# Altium schematic sheet BSR033A_Hardware.SchDoc: LM5180EVM-S03 Buck Converter Hardware
size 431 x 279 mm; Date: Not shown in title block; ApprovedBy: Not shown in title block; CheckedBy: Not shown in title block; Author: Not shown in title block; CompanyName: Not shown in title block; DrawnBy: K. Nielson; Engineer: Not shown in title block; Organization: Not shown in title block; Address1: Not shown in title block; Address2: Not shown in title block; Address3: Not shown in title block; Address4: Not shown in title block; DocumentNumber: 2; Revision: Use project parameter SCH_Rev; SheetNumber: 2; SheetTotal: 2; PageSetup: Record=PageOptions|CenterHorizontal=True|CenterVertical=True|PrintScale=1.00|XCorrection=1.00|YCorrection=1.00|PrintKind=0|BorderSize=5000000|LeftOffset=0|BottomOffset=0|Orientation=2|PaperLength=1000|PaperWidth=1000|Scale=100|PaperSource=15|PrintQuality=600|MediaType=1|DitherType=10|PaperKind=Letter|PrintScaleMode=1; CurrentTime: Not shown in title block; CurrentDate: Not shown in title block; Time: Not shown in title block; DocumentFullPathAndName: Not shown in title block; DocumentName: Not shown in title block; ModifiedDate: Not shown in title block; ImagePath: Not shown in title block
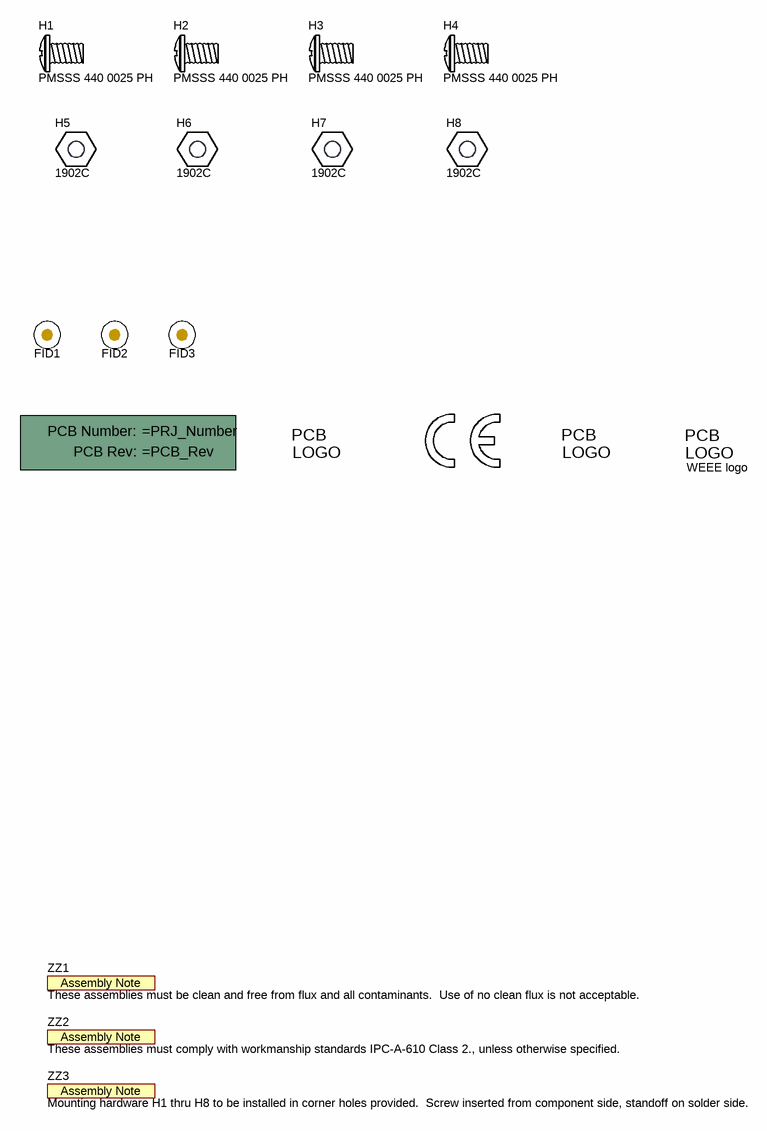
[diagram p0: BSR033A_Hardware.SchDoc]

## Parts
!PCB  Printed Circuit Board  (value not drawn)  (mechanical)
FID1  Fiducial  [Fiducial10-20]  (value not drawn)
FID2  Fiducial  [Fiducial10-20]  (value not drawn)
FID3  Fiducial  [Fiducial10-20]  (value not drawn)
H1  PMSSS 440 0025 PH  [B_F_PMSSS4400025PH]
H2  PMSSS 440 0025 PH  [B_F_PMSSS4400025PH]
H3  PMSSS 440 0025 PH  [B_F_PMSSS4400025PH]
H4  PMSSS 440 0025 PH  [B_F_PMSSS4400025PH]
H5  1902C  [Keystone_1902C]
H6  1902C  [Keystone_1902C]
H7  1902C  [Keystone_1902C]
H8  1902C  [Keystone_1902C]
Logo1  Texas Instruments  [TI_Stacked_Overlay_Small]  (value not drawn)  (no BOM)
Logo2  WEEE logo  [WEEE_Minimum]  (no BOM)
Logo3  FCC disclaimer  [FCC_disclaimer_stacked]  (value not drawn)  (no BOM)
LOGO4  CE Mark  [CE_Mark_5mm]  (value not drawn)  (no BOM)
ZZ1  These assemblies must be clean and free from flux and all contaminants.  Use of no clean flux is not acceptable.  [AssemblyNote]  (no BOM)
ZZ2  These assemblies must comply with workmanship standards IPC-A-610 Class 2., unless otherwise specified.  [AssemblyNote]  (no BOM)
ZZ3  Mounting hardware H1 thru H8 to be installed in corner holes provided.  Screw inserted from component side, standoff on solder side.  [AssemblyNote]  (no BOM)

## Notes on the sheet
- Drawn By:
- SVN Rev:
- Number:
- TID #:
- Orderable:
- Rev:
- Sheet Title:
- File:
- Project Title:
- Designed for:
- Assembly Variant:
- Mod. Date:
- Sheet:
- Size:
- of
- B
- http://www.ti.com
- Texas Instruments and/or its licensors do not warrant the accuracy or completeness of this specification or any information contained therein. Texas Instruments and/or its licensors do not warrant that this design will meet the specifications, will be suitable for your application or fit for any particular purpose, or will operate in an implementation. Texas Instruments and/or its licensors do not warrant that the design is production worthy. You should completely validate and test your design implementation to confirm the system functionality for your application.
- Engineer:
- Contact:
- © Texas Instruments
- (in symbol AssemblyNote) Assembly Note
- (in symbol CMP-0074769-1) PCB; LOGO
- (in symbol FCC_disclaimer) PCB; LOGO
- (in symbol PCB) PCB Number:; PCB Rev:
- (in symbol TI_Logo) PCB; LOGO

## Library data of the parts
!PCB = PCB: Manufacturer: Any; SymbolCreator: a0412235; SymbolVersion: 2012-05-30; CompType: PCB; PartNumber: =PRJ_Number; RoHS: O; MountType: N/A; Publisher: Texas Instruments; LatestRevisionDate: 2017-05-23
FID1-FID3 = Fiducial: Fiducial mark.  There is nothing to buy or mount.; SymbolCreator: codlsc; SymbolVersion: 2009-11-4; CompType: Fiducial; Publisher: Texas Instruments; LatestRevisionDate: 2016-12-05; LatestRevisionNote: Added Alternate PartNumber and Alternate Manufacturer parameters to appropriate components.; Manufacturer: N/A; MountType: N/A; PackageReference: N/A; PartNumber: N/A; ClassName: FiducialMark
H1 H2 H4 = CMP-0003715-1: MACHINE SCREW PAN PHILLIPS 4-40; Manufacturer: B&F Fastener Supply; CompType: Standoff; Component Classes: MountingHoles; ComponentLink1URL: http://www.fasnetdirect.com/refguide/Machinepancombo.pdf; Key: PMSSS 440 0025 PH; Publisher: Texas Instruments; Supplier 1: Digi-Key; PackageReference: Machine Screw, 4-40, 1/4 inch; LatestRevisionDate: 2017-03-09; RoHS: Y; Supplier Part Number 1: H703-ND; MountType: TH; PartNumber: PMSSS 440 0025 PH; ComponentLink1Description: Datasheet Link; ClassName: Mounting Holes
H3 = CMP-0003715-1: MACHINE SCREW PAN PHILLIPS 4-40; Manufacturer: B&F Fastener Supply; CompType: Standoff; Component Classes: MountingHoles; Rule: PcbType=ProtelPcb; ComponentLink1URL: http://www.fasnetdirect.com/refguide/Machinepancombo.pdf; Key: PMSSS 440 0025 PH; Publisher: Texas Instruments; Supplier 1: Digi-Key; PackageReference: Machine Screw, 4-40, 1/4 inch; LatestRevisionDate: 2017-03-09; RoHS: Y; Supplier Part Number 1: H703-ND; MountType: TH; PartNumber: PMSSS 440 0025 PH; ComponentLink1Description: Datasheet Link; ClassName: Mounting Holes
H5-H8 = CMP-0003610-1: Standoff, Hex, 0.5"L #4-40 Nylon; Manufacturer: Keystone; CompType: Hardware; Component Classes: MountingHoles; ComponentLink1URL: http://www.keyelco.com/pdfs/M55-prod31.pdf; Key: 1902C; Publisher: Texas Instruments; Supplier 1: Digi-Key; PackageReference: Standoff; LatestRevisionDate: 2017-03-09; RoHS: Y; Supplier Part Number 1: 36-1902C-ND; MountType: N/A; PartNumber: 1902C; ComponentLink1Description: Datasheet Link; ClassName: Mounting Holes
Logo1 = TI_Logo: Texas Instrument Corporate Signature; SymbolCreator: a0412235; SymbolVersion: 2011-08-22; Published: 2009-03-03; Publisher: Texas Instruments; ClassName: Logo; LatestRevisionDate: 2016-03-21
Logo2 = CMP-0074769-1: Library Reference: WEEE logo; Lib Reference: WEEE logo; PartNumber: WEEE logo
Logo3 = FCC_disclaimer: SymbolCreator: a0412235; SymbolVersion: 2016-03-21; Published: 2009-03-03; Publisher: Texas Instruments; LatestRevisionDate: 2016-03-21
LOGO4 = CE Mark: SymbolCreator: a0412235; SymbolVersion: 2014-07-08; Published: 2009-03-03; Publisher: Texas Instruments; LatestRevisionDate: 2016-03-21
ZZ1-ZZ3 = AssemblyNote: SymbolCreator: codlsc; SymbolVersion: 2010-05-18; CompType: AssemblyNote; ClassName: AssemblyNote; Publisher: Texas Instruments; LatestRevisionDate: 2017-05-23